# EAGLE design hello (EAGLE 7.7.0)
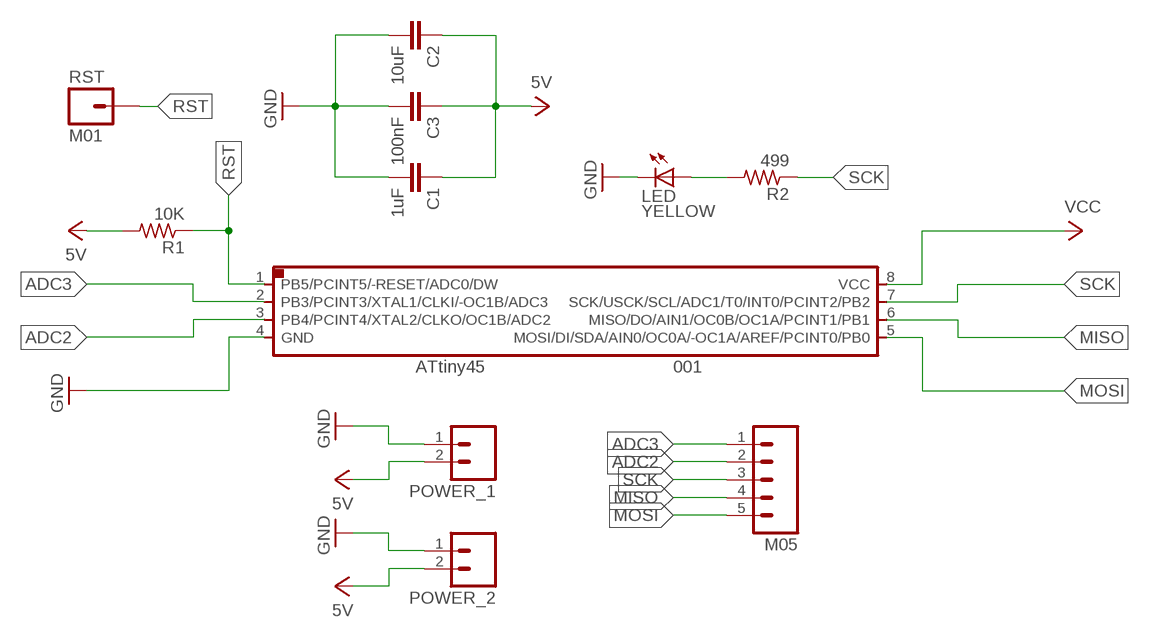
[diagram p0: schematic, sheet 1]

## Parts
001  ATTINY45SI  [SOIC8]
C1  1uF  CAP1206  [1206]
C2  10uF  CAP1206  [1206]
C3  100nF  CAP1206  [1206]
LED  YELLOW  LEDFAB1206  [LED1206FAB]
M05  M05  [05P]
POWER_1  M02  [02P]
POWER_2  M02  [02P]
R1  10K  RES-US1206FAB  [R1206FAB]
R2  499  RES-US1206FAB  [R1206FAB]
RST  M01  M01PTH_LONGPAD  [1X01_LONGPAD]

## Nets
ADC2: 001.3(PB4/PCINT4/XTAL2/CLKO/OC1B/ADC2) M05.2
ADC3: 001.2(PB3/PCINT3/XTAL1/CLKI/-OC1B/ADC3) M05.1
GND: 001.4(GND) C1.2 C2.2 C3.2 LED.2(C) POWER_1.1 POWER_2.1
MISO: 001.6(MISO/DO/AIN1/OC0B/OC1A/PCINT1/PB1) M05.4
MOSI: 001.5(MOSI/DI/SDA/AIN0/OC0A/-OC1A/AREF/PCINT0/PB0) M05.5
N$8: LED.1(A) R2.2
RST: 001.1(PB5/PCINT5/-RESET/ADC0/DW) R1.1 RST.1
SCK: 001.7(SCK/USCK/SCL/ADC1/T0/INT0/PCINT2/PB2) M05.3 R2.1
VCC: 001.8(VCC) C1.1 C2.1 C3.1 POWER_1.2 POWER_2.2 R1.2 ; supply symbol labelled 5V

## Library data of the parts
001 = fab:ATTINY45
C1-C3 = 01_SparkFun:CAP: Capacitor Standard 0603 ceramic capacitor, and 0.1" leaded capacitor.
LED = fablab:LED: LED
M05 = con-amp-quick:M05: AMP QUICK CONNECTOR; OC_FARNELL: unknown; OC_NEWARK: unknown
POWER_1 POWER_2 = con-amp-quick:M02: AMP QUICK CONNECTOR; OC_FARNELL: unknown; OC_NEWARK: unknown
R1 = fab:RES-US: Resistor (US Symbol) Variants with postfix FAB are widened to allow the routing of internal traces
R2 = fablab:RES-US: Resistor (US Symbol) Variants with postfix FAB are widened to allow the routing of internal traces
RST = 01_SparkFun:M01: Header 1 Standard 1-pin 0.1" header. Use with straight break away headers (SKU : PRT-00116), right angle break away headers (PRT-00553), swiss pins (PRT-00743), machine pins (PRT-00117), and female headers (PRT-00115).

## Board
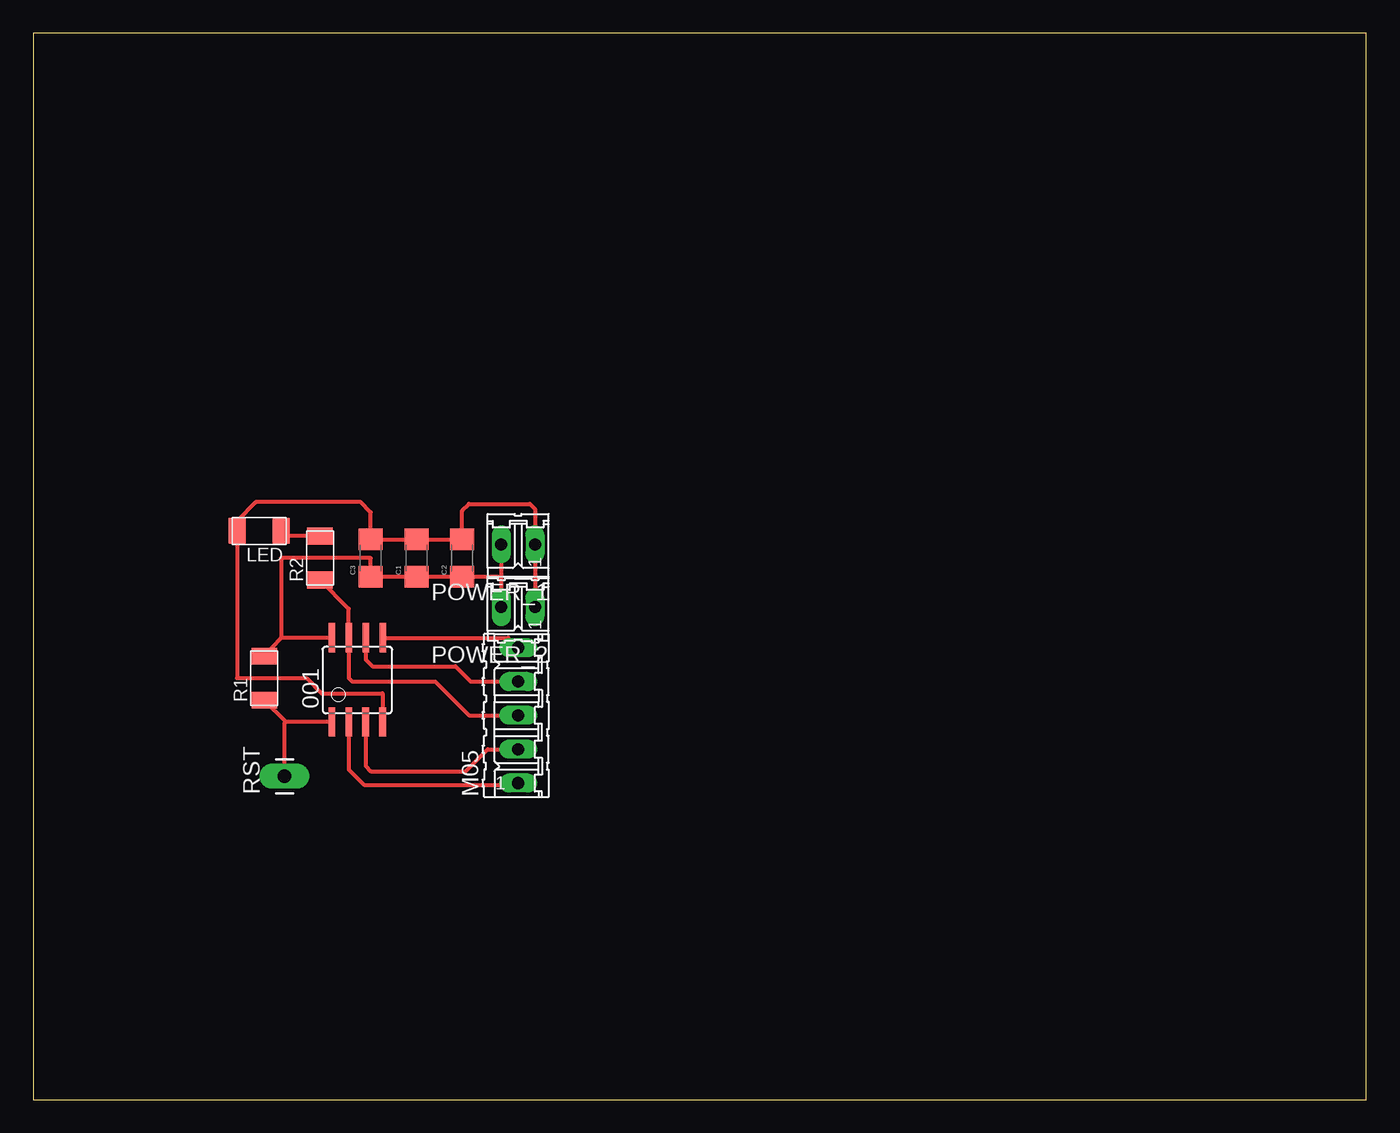
[diagram p1: board, top side]

Size 100 x 80 mm. Coordinates in mm from the lower left corner, seen from the top.
Outline: 100,80 0,80 0,0 100,0 100,80
Copper layers (1*16): Top 0.035mm / dielectric 1.5mm / Bottom 0.035mm
Design rules "default": minimum track width 10mil, minimum drill 24mil, track to track 8mil, track to pad 8mil, pad to pad 8mil, via to via 8mil, smd to smd 8mil, copper to edge 40mil, drill to drill 8mil, minimum pad ring 10mil, minimum via ring 8mil, stop-mask expansion 4mil, vias tented up to drill 0mil, thermal gap 10mil

### Footprints (pad centres in the part's own frame; a part is rotated, then mirrored left to right if it is on the bottom)
SOIC8 = smd 0.5 x 2.2: 1 -1.905,-3.154; 2 -0.645,-3.154; 3 0.625,-3.154; 4 1.895,-3.154; 5 1.905,3.154; 6 0.635,3.154; 7 -0.635,3.154; 8 -1.905,3.154
1206 = smd 1.6 x 1.8: 1 -1.4,0; 2 1.4,0
LED1206FAB = smd 1.27 x 1.905: 1 -1.651,0; 2 1.651,0
05P = drill 0.914 long: 1 -5.08,0; 2 -2.54,0; 3 0,0; 4 2.54,0; 5 5.08,0
02P = drill 0.914 long: 1 -1.27,0; 2 1.27,0
R1206FAB = smd 1.27 x 1.905: 1 -1.651,0; 2 1.651,0
1X01_LONGPAD = drill 1.016 pad 1.88 long: 1 0,0

### Placement (x,y rotation side)
001  24.31,31.49 0 top
C1  28.75,40.63 90 top
C2  32.18,40.63 90 top
C3  25.32,40.63 90 top
LED  16.94,42.66 180 top
M05  36.37,28.82 90 top
POWER_1  36.37,41.65 180 top
POWER_2  36.37,36.95 180 top
R1  17.32,31.61 90 top
R2  21.51,40.63 90 top
RST  18.85,24.25 90 top

### Tracks (layer width: path | path; a pad name or v marks a point on that pad's centre or on a via)
ADC2
  Top 0.305: 001.3 24.93,25.02 25.32,24.63 32.44,24.63 34.09,26.28 M05.2
ADC3
  Top 0.305: 001.2 23.66,24.76 24.82,23.61 36.25,23.61 M05.1
GND
  Top 0.305: 26.21,28.34 001.4 26.2,30.47 21.64,30.47 20.5,31.61 15.29,31.61 LED.2 15.29,43.42 16.69,44.82 24.56,44.82 25.32,44.06 C3.2 C1.2 C2.2 32.18,44.19 32.69,44.69 37.26,44.69 37.64,44.31 POWER_1.1 POWER_2.1
MISO
  Top 0.305: 001.6 24.94,33.01 25.45,32.5 31.67,32.5 32.82,31.36 M05.4
MOSI
  Top 0.305: 001.5 35.63,34.64 M05.5
N$8
  Top 0.305: 18.59,42.79 LED.1 | LED.1 18.59,42.28 | R2.2 18.97,42.28 LED.1
RST
  Top 0.305: 001.1 18.95,28.33 | 18.95,28.33 R1.1 | 18.95,28.33 18.85,28.23 RST.1
SCK
  Top 0.305: R2.1 23.67,36.82 001.7 23.67,31.61 23.93,31.36 30.15,31.36 32.69,28.82 M05.3
VCC
  Top 0.305: 001.8 18.59,34.64 | 18.59,34.64 18.59,40.63 25.32,40.63 C3.1 C1.1 C2.1 35.1,39.23 | R1.2 18.59,34.64 | POWER_1.2 35.1,39.23 | 35.1,39.23 POWER_2.2